# Altium project Combined_Power_Actuator.PrjPcb
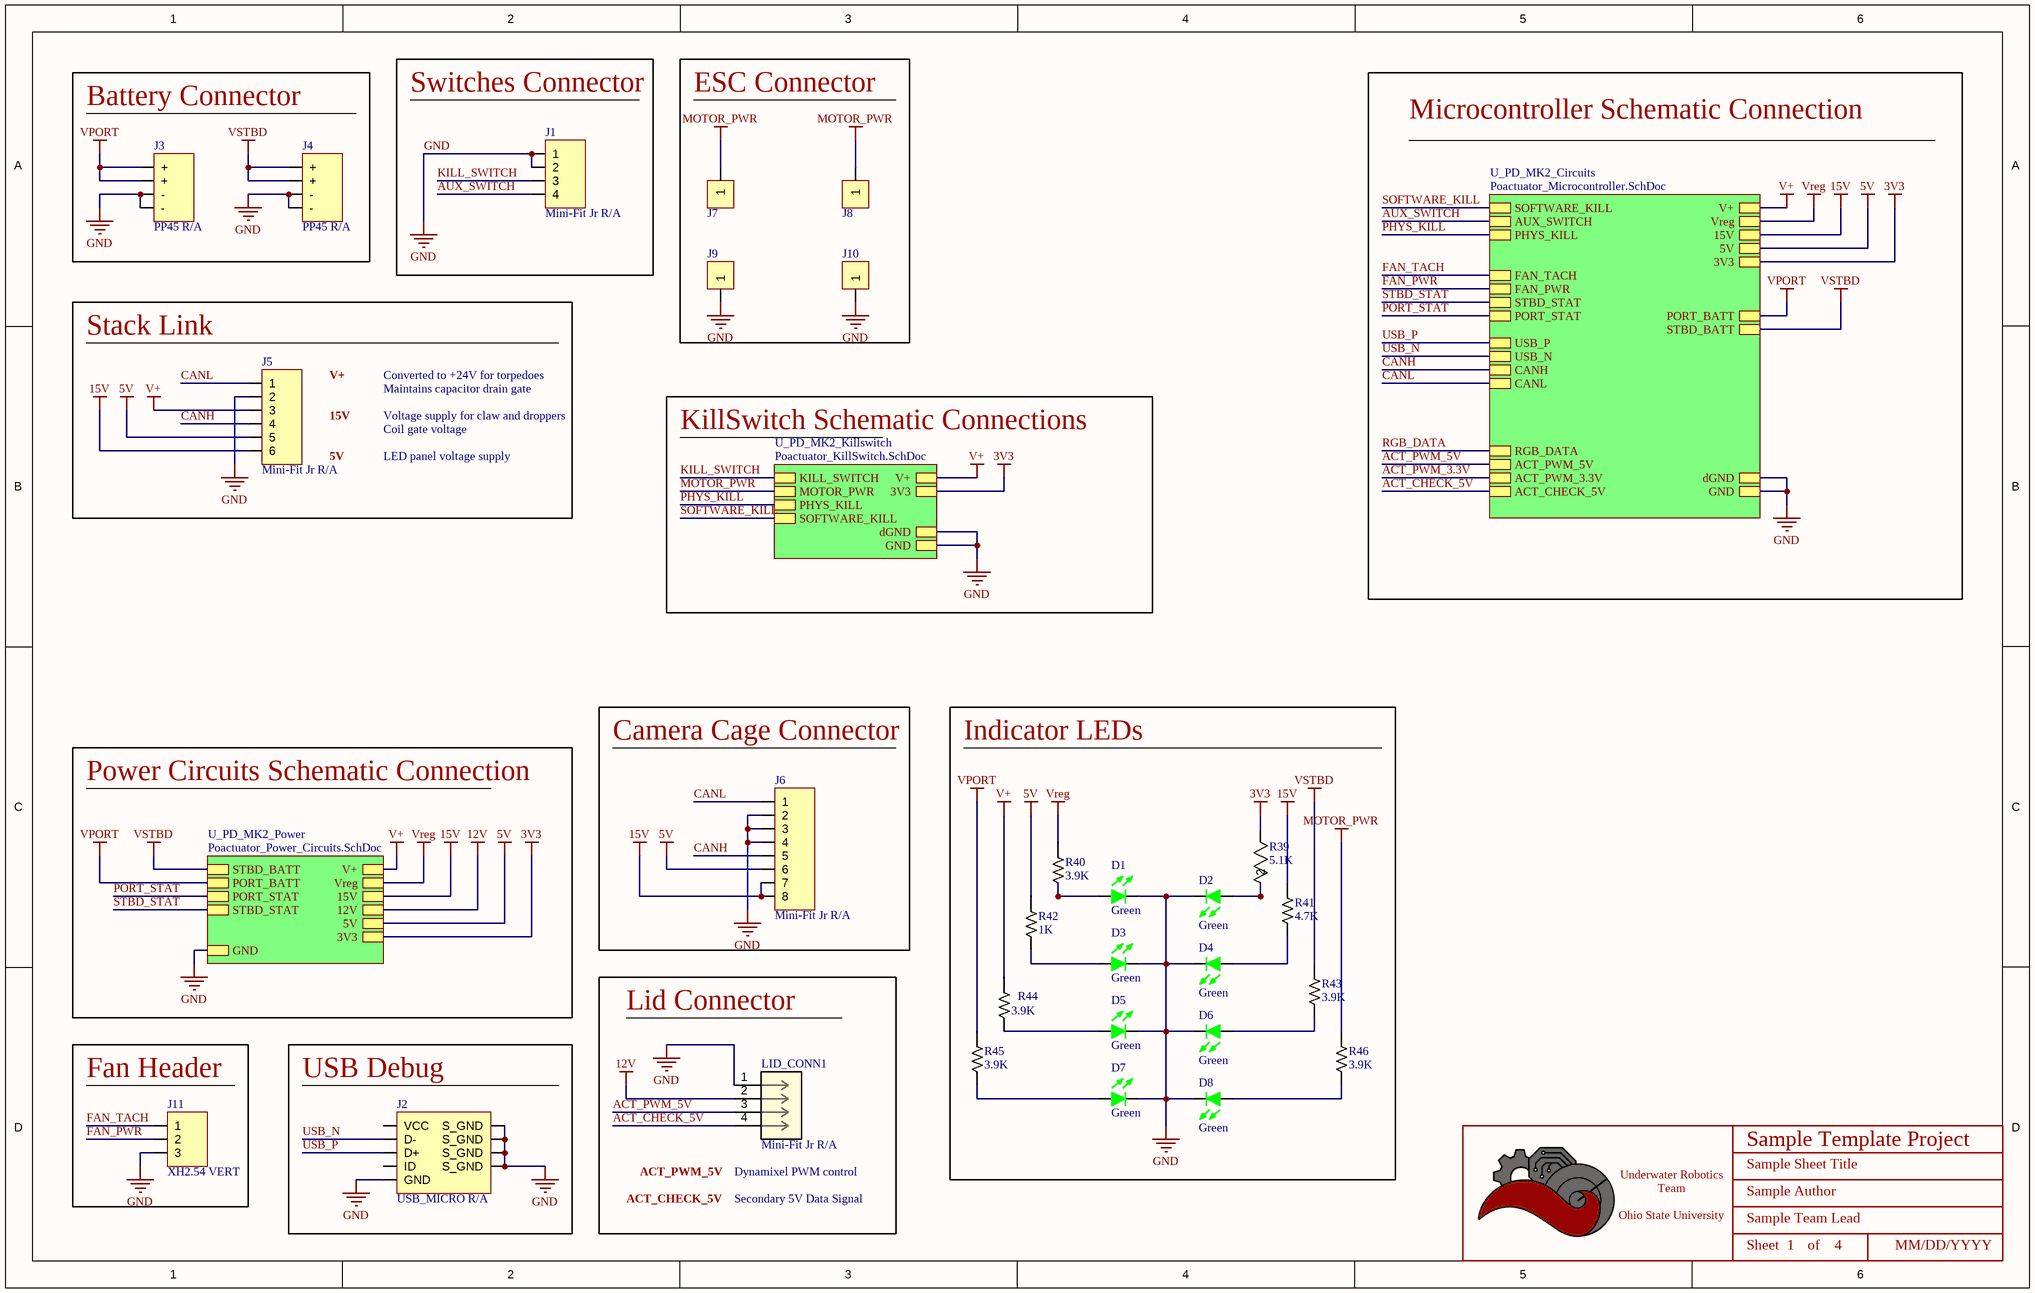
[diagram p0: Poactuator_Connectors.SchDoc]
BoardRevision: 1.0; DateOfDesignReview: XX/XX/XXXX; ProjectTitle: Sample Template Project; TeamLead: Sample Team Lead
4 sheets, 105 parts. Net scope: hierarchical (ports join the sheet entries above them; power ports are global).
Board file: PoactuatorPCB4.PcbDoc
Sheets:
  Poactuator_Connectors.SchDoc
    U_PD_MK2_Power = Poactuator_Power_Circuits.SchDoc
    U_PD_MK2_Circuits = Poactuator_Microcontroller.SchDoc
    U_PD_MK2_Killswitch = Poactuator_KillSwitch.SchDoc

## Sheet Poactuator_Connectors.SchDoc: Sample Sheet Title
size B; Date: MM/DD/YYYY; Author: Sample Author; Organization: ORGANIZATION; Address1: ADDRESS 1; Address2: ADDRESS 2; Address3: ADDRESS 3; Address4: ADDRESS 4; Revision: -; SheetNumber: 1; SheetTotal: 4; ENG_APP_DATE: --/--/--; DSN_APP_DATE: --/--/--; CHK_APP_DATE: --/--/--

### Parts
(Parts that share a designator on the sheet are numbered #1, #2 ... from top to bottom, then left to right.)
*#1  Title_Block  [LOGO]  (value not drawn)  (graphical)
D1  Color: Green  [LED_0603]  (hidden comment: IN-S63AT5G)
D2  Color: Green  [LED_0603]  (hidden comment: IN-S63AT5G)
D3  Color: Green  [LED_0603]  (hidden comment: IN-S63AT5G)
D4  Color: Green  [LED_0603]  (hidden comment: IN-S63AT5G)
D5  Color: Green  [LED_0603]  (hidden comment: IN-S63AT5G)
D6  Color: Green  [LED_0603]  (hidden comment: IN-S63AT5G)
D7  Color: Green  [LED_0603]  (hidden comment: IN-S63AT5G)
D8  Color: Green  [LED_0603]  (hidden comment: IN-S63AT5G)
J1  Mini-Fit Jr R/A  [CONN_MOLEX_MINIFIT JR_4 POS_R/A]
J2  USB_MICRO R/A  [CONN_MINIUSB]
J3  PP45 R/A  [CONN_ANDERSON_PP45_4 POS_R/A]
J4  PP45 R/A  [CONN_ANDERSON_PP45_4 POS_R/A]
J5  Mini-Fit Jr R/A  [CONN_MOLEX_MINIFIT JR_6 POS_R/A]
J6  Mini-Fit Jr R/A  [CONN_MOLEX_MINIFIT JR_8 POS_R/A]
J7  Redcube M4 Term 85A  [Redcube M4 Term 85A]  (value not drawn)
J8  Redcube M4 Term 85A  [Redcube M4 Term 85A]  (value not drawn)
J9  Redcube M4 Term 85A  [Redcube M4 Term 85A]  (value not drawn)
J10  Redcube M4 Term 85A  [Redcube M4 Term 85A]  (value not drawn)
J11  XH2.54 VERT  [CONN_JST_XH254_3POS_VERT]
LID_CONN1  Mini-Fit Jr R/A  [CONN HEADER R/A 4POS 4.2MM]
R39  5.1K  [RC0603N_PAN]
R40  Value  (Ohms): 3.9K  [RESISTOR_0603]  (hidden comment: 3.9k Ohm 5% 1/10W)
R41  Value  (Ohms): 4.7K  [RESISTOR_0603]  (hidden comment: 4.7k Ohm 5% 1/10W)
R42  Value  (Ohms): 1K  [RESISTOR_0603]  (hidden comment: 1k Ohm 5% 1/8W)
R43  Value  (Ohms): 3.9K  [RESISTOR_0603]  (hidden comment: 3.9k Ohm 5% 1/10W)
R44  Value  (Ohms): 3.9K  [RESISTOR_0603]  (hidden comment: 3.9k Ohm 5% 1/10W)
R45  Value  (Ohms): 3.9K  [RESISTOR_0603]  (hidden comment: 3.9k Ohm 5% 1/10W)
R46  Value  (Ohms): 3.9K  [RESISTOR_0603]  (hidden comment: 3.9k Ohm 5% 1/10W)

### Blocks framed on the sheet
Switches Connector: J1
ESC Connector: J7-J10
Battery Connector: J3 J4
Stack Link: J5
Camera Cage Connector: J6
Indicator LEDs: D1-D8 R39-R46
Lid Connector: LID_CONN1
Fan Header: J11
USB Debug: J2

### Sub-sheets
U_PD_MK2_Circuits = Poactuator_Microcontroller.SchDoc: GND, V+, 5V, 3V3, SOFTWARE_KILL, AUX_SWITCH, FAN_TACH, FAN_PWR, 15V, dGND, Vreg, STBD_STAT, PORT_STAT, USB_P, USB_N, STBD_BATT, CANH, CANL, PORT_BATT, RGB_DATA, ACT_PWM_5V, ACT_PWM_3.3V, ACT_CHECK_5V, PHYS_KILL
U_PD_MK2_Killswitch = Poactuator_KillSwitch.SchDoc: KILL_SWITCH, MOTOR_PWR, V+, 3V3, dGND, GND, PHYS_KILL, SOFTWARE_KILL
U_PD_MK2_Power = Poactuator_Power_Circuits.SchDoc: STBD_BATT, PORT_BATT, GND, V+, 15V, 5V, 3V3, PORT_STAT, STBD_STAT, Vreg, 12V

### Nets
3V3: R39.1 ; sheet U_PD_MK2_Power/3V3, sheet U_PD_MK2_Circuits/3V3, sheet U_PD_MK2_Killswitch/3V3
5V: J5.5 J6.6 R42.1 ; sheet U_PD_MK2_Power/5V, sheet U_PD_MK2_Circuits/5V
12V: LID_CONN1.2 ; sheet U_PD_MK2_Power/12V
15V: J5.6 J6.7 J6.8 R41.1 ; sheet U_PD_MK2_Power/15V, sheet U_PD_MK2_Circuits/15V
GND: D1.2 D2.2 D3.2 D4.2 D5.2 D6.2 D7.2 D8.2 J1.1 J1.2 J2.5(GND) J2.6(S_GND) J2.7(S_GND) J2.8(S_GND) J2.9(S_GND) J3.3(-) J3.4(-) J4.3(-) J4.4(-) J5.2 J6.2 J6.3 J6.4 J9.1 J10.1 J11.3 LID_CONN1.1 ; sheet U_PD_MK2_Power/GND, sheet U_PD_MK2_Circuits/GND, sheet U_PD_MK2_Circuits/dGND, sheet U_PD_MK2_Killswitch/dGND, sheet U_PD_MK2_Killswitch/GND
MOTOR_PWR: J7.1 J8.1 R46.1 ; sheet U_PD_MK2_Killswitch/MOTOR_PWR
V+: J5.3 R44.1 ; sheet U_PD_MK2_Power/V+, sheet U_PD_MK2_Circuits/V+, sheet U_PD_MK2_Killswitch/V+
VPORT: J3.1(+) J3.2(+) R45.1 ; sheet U_PD_MK2_Power/PORT_BATT, sheet U_PD_MK2_Circuits/PORT_BATT
Vreg: R40.1 ; sheet U_PD_MK2_Power/Vreg, sheet U_PD_MK2_Circuits/Vreg
VSTBD: J4.1(+) J4.2(+) R43.1 ; sheet U_PD_MK2_Power/STBD_BATT, sheet U_PD_MK2_Circuits/STBD_BATT
ACT_CHECK_5V: LID_CONN1.4 ; sheet U_PD_MK2_Circuits/ACT_CHECK_5V
ACT_PWM_5V: LID_CONN1.3 ; sheet U_PD_MK2_Circuits/ACT_PWM_5V
AUX_SWITCH: J1.4 ; sheet U_PD_MK2_Circuits/AUX_SWITCH
CANH: J5.4 J6.5 ; sheet U_PD_MK2_Circuits/CANH
CANL: J5.1 J6.1 ; sheet U_PD_MK2_Circuits/CANL
FAN_PWR: J11.2 ; sheet U_PD_MK2_Circuits/FAN_PWR
FAN_TACH: J11.1 ; sheet U_PD_MK2_Circuits/FAN_TACH
KILL_SWITCH: J1.3 ; sheet U_PD_MK2_Killswitch/KILL_SWITCH
PHYS_KILL: sheet U_PD_MK2_Circuits/PHYS_KILL, sheet U_PD_MK2_Killswitch/PHYS_KILL
PORT_STAT: sheet U_PD_MK2_Power/PORT_STAT, sheet U_PD_MK2_Circuits/PORT_STAT
RGB_DATA: sheet U_PD_MK2_Circuits/RGB_DATA
SOFTWARE_KILL: sheet U_PD_MK2_Circuits/SOFTWARE_KILL, sheet U_PD_MK2_Killswitch/SOFTWARE_KILL
STBD_STAT: sheet U_PD_MK2_Power/STBD_STAT, sheet U_PD_MK2_Circuits/STBD_STAT
USB_N: J2.2(D-) ; sheet U_PD_MK2_Circuits/USB_N
USB_P: J2.3(D+) ; sheet U_PD_MK2_Circuits/USB_P
NetD1_1: D1.1 R40.2
NetD2_1: D2.1 R39.2
NetD3_1: D3.1 R42.2
NetD4_1: D4.1 R41.2
NetD5_1: D5.1 R44.2
NetD6_1: D6.1 R43.2
NetD7_1: D7.1 R45.2
NetD8_1: D8.1 R46.2

Not connected (* = marked no-connect by the designer): J2 1(VCC) 4(ID)

### Notes on the sheet
- Microcontroller Schematic Connection
- V+
- 15V
- Converted to +24V for torpedoes
- Voltage supply for claw and droppers
- Coil gate voltage
- Maintains capacitor drain gate
- KillSwitch Schematic Connections
- 5V
- LED panel voltage supply
- Power Circuits Schematic Connection
- ACT_PWM_5V
- (near LID_CONN1) Dynamixel PWM control
- ACT_CHECK_5V
- Secondary 5V Data Signal
- DWG. NO.
- REV.
- SHT.
- THIS DOCUMENT AND THE DATA DISCLOSED HEREIN OR HEREWITH IS THE PROPERTY OF ALTIUM LIMITED AND MAY BE FREELY DISTRIBUTED IN WHOLE. NO RIGHTS ARE RESERVED OR EXPRESS OR IMPLIED WARANTEE GIVEN.
- REVISION
- DESCRIPTION
- DATE
- APPROVED
- ENG:
- APPROVALS
- PROJECT
- DSN:
- CHK:
- REFERENCE DOCUMENTS
- PROJECT REVISION:
- TITLE
- DOCUMENT REVISION:
- DESIGN ITEM:
- BOM:
- FAB DWG:
- PCB DWG:
- ASSY DWG:
- SCALE:
- SIZE
- B
- CAGE CODE
- FILE NAME
- DWG NO.
- SHEET
- OF
- REV
- (in symbol Title_Block) Underwater Robotics Team / Ohio State University; Sheet; of

### Library data of the parts
*#1 = Title_Block: UWRT Schematic Title Block Template / Created June 2021, Dylan Trainor
D1-D8 = LED_Green_0603_3V: LED Green Vf= 3V If = 0.005A / IN-S63AT5G; Made By: Robert Pafford; Forward Current: 5mA; ComponentLink1Description: Datasheet; ComponentLink1URL: https://www.we-online.de/katalog/datasheet/150060GS75000.pdf; Forward Voltage: 3V; Package: 0603; Supplier 1: Digi-Key; Supplier Part Number 1: 1830-1062-1-ND
J1 = CONN_MOLEX_MINIFIT JR_4POS_R/A: Molex Minifit Jr. 5569 / 4 Pos R/A Natural; Pitch: 4.2mm; Configuration: Right Angle; Current Per Pin: 13A; Number of Positions: 4; Supplier Part Number 1: WM13112-ND; Supplier 1: Digi-Key; Manufacturer: Molex; Color: Natural; Created By: Flip B; ComponentLink1Description: Datasheet; ComponentLink1URL: https://www.molex.com/pdm_docs/sd/026013115_sd.pdf; Series: Minifit Jr 5569
J2 = CONN_MICROUSB: Amphenol Micro USB-B / USB2.0 5 Pin Right Angle SMD; Pitch: 0.65mm; Current Per Pin: 1.8A; Number of Positions: 5; Manufacturer: Amphenol; Configuration: Right Angle; Color: Silver; Created By: Flip B; ComponentLink1Description: Datasheet; ComponentLink1URL: https://cdn.amphenol-icc.com/media/wysiwyg/files/documentation/datasheet/inputoutput/io_usb_micro.pdf?__cf_chl_jschl_tk__=05693735e19256298f6ef6ca2bb2e65c376a4f56-1625503833-0-Abitsb0-ufjOXJYs_S3J3r2iTn-nObalbmXUksF1VvO_h_WEmRdMlUD1I8-hmWSEVWzY1pirKnrPZWfgY3851qyBZe5ZvnNQePLGIzUgdEIQBVUyW36RsbYpDLEWxJ4horD-5gChFgobLYqwmG5aHl0E8lIn_twwPPrOxilK2gP0q9t_CNOs_u5fMqXvXUrlsOv8tIE2NRlu6NVP8qtkL2GjhlkeTUbDMF8WvvpPDTFOgvZ4Y16Ej8F8AhWos88mo5B1HssXozw0XrkJQIqERITUu6rqloz9kf4ZzhBHtDAt-IkiAFY_Ds9SW8FYKKTtINJVpHZQ6Gyu1FFM4Dc9MO0maE8_mmNcwlxqyRoRk_MPWW8VyByXWM5RSp52jteRKw7FeI9WIYvCbPAOy0Eyib-aseIQsnGbglBcUY6_2xp8GYaJM38H3dNvBPsSOfJBPndKedwKHllxjkucXn6xsN0sDXkpGN-cu8_2bDTJ0g-uUucKSCooYX-ApSDNGpkA_p9zv1SOAD8c0zaZVmtiBsN75QpVz2rzq9_BFxOywPvR; Series: 10118192; Supplier 1: Digi-Key; Supplier Part Number 1: 609-4613-1-ND
J3 J4 = CONN_ANDERSON_2x2_R/A: Anderson PP45 / 4 Pos R/A Red/Black; Pitch: 7.9mm; Configuration: Right Angle; Current Per Pin: 45A; Number of Positions: 4; Manufacturer: Anderson; Color: Red/Black; Created By: Flip B; ComponentLink1Description: Datasheet; ComponentLink1URL: https://www.andersonpower.com/content/dam/app/ecommerce/product-pdfs/DS-PP1545.pdf; Series: PowerPole 45; Supplier 1: Digi-Key; Supplier Part Number 1: 2243-1337G1-ND; Supplier 2: Digi-Key; Supplier Part Number 2: 2243-1336G1-ND; Supplier 3: Digi-Key; Supplier Part Number 3: 2243-1327-BK-ND; Supplier 4: Digi-Key; Supplier Part Number 4: A102007-ND
J5 = CONN_MOLEX_MINIFIT JR_6POS_R/A: Molex Minifit Jr. 5569 / 6 Pos R/A Natural; Pitch: 4.2mm; Configuration: Right Angle; Current Per Pin: 13A; Number of Positions: 8; Manufacturer: Molex; Color: Natural; Created By: Flip B; ComponentLink1Description: Datasheet; ComponentLink1URL: https://www.molex.com/pdm_docs/ps/PS-5556-001.pdf; Series: Minifit Jr 5569; Supplier 1: Digi-Key; Supplier Part Number 1: WM1353-ND
J6 = CONN_MOLEX_MINIFIT JR_8POS_R/A: Molex Minifit Jr. 5569 / 8 Pos R/A Natural; Pitch: 4.2mm; Configuration: Right Angle; Current Per Pin: 13A; Number of Positions: 8; Manufacturer: Molex; Color: Natural; Created By: Flip B; ComponentLink1Description: Datasheet; ComponentLink1URL: https://www.molex.com/pdm_docs/ps/PS-5556-001.pdf; Series: Minifit Jr 5569; Supplier 1: Digi-Key; Supplier Part Number 1: WM1354-ND
J11 = CONN_JST_XH254_3POS_VERT: JST XH 2.54mm Pitch 3 Pos Vertical; Current Per Pin: 4A; Number of Positions: 3; NOTE: Do not use JST 2.5mm parts with this footprint. JST does not make 2.54mm pitch pins, rather only clones make this connector!; Manufacturer: JST; Pitch: 2.54mm; Configuration: Vertical; Color: White; Created By: Robert P; Series: XH 2.54; ComponentLink1Description: Purchase Link; ComponentLink1URL: https://www.amazon.com/460PCS-XH2-54-Connector-Terminal-Connectors/dp/B09DBGVX5C
LID_CONN1 = CONN HEADER R/A 4POS 4.2MM: Mini-Fit Jr Connector Header Through Hole, Right Angle 4 position 0.165" (4.20mm); Manufacturer: Molex; Pitch: 4.2mm; Number of Positions: 4; Max. Current Per Pin: 100mA; Supplier Part Number 1: WM23323-ND; Supplier 1: Digi-Key; Configuration: Right Angle; Color: Natural; Created By: Zach Ramsey; Series: Minifit Jr 5569; ComponentLink2Description: Datasheet; ComponentLink2URL: https://tools.molex.com/pdm_docs/ps/PS-5556-001.pdf
R39 = ERA-3AEB512V_2: 5.1 kOhms ±0.1% 0.1W, 1/10W Chip Resistor 0603 (1608 Metric) Automotive AEC-Q200 Thin Film; Mfr_Name: Panasonic; Copyright: Copyright (C) 2023 Ultra Librarian. All rights reserved.; Manufacturer_Part_Number: ERA-3AEB512V; RefDes: RefDes; Type: DEV
R40 R43-R46 = RESISTOR_3.9K_0603: RES 3.9k OHM 1% 1/10W 0603; Tolerance: +/- 1%; Made By: Robert Pafford; Wattage: 1/10W; Supplier 1: Digi-Key; Supplier Part Number 1: P3.90KHCT-ND
R41 = RESISTOR_4.7K_0603: RES 4.7k OHM 5% 1/10W 0603; Tolerance: +/- 5%; Made By: Robert Pafford; Wattage: 1/10W; Supplier: Digikey; Digikey Part Numer: CR0603-JW-104ELFTR-ND; Supplier 1: Digi-Key; Supplier Part Number 1: RMCF0603JT4K70CT-ND
R42 = RESISTOR_1K_0603: RES 1k OHM 5% 1/8W 0603; Tolerance: +/- 5%; Made By: Robert Pafford; ComponentLink1Description: Datasheet; ComponentLink1URL: https://www.bourns.com/docs/product-datasheets/CRxxxxx.pdf; Wattage: 1/8W; Supplier: Digikey; Digikey Part Numer: CR0603-JW-104ELFTR-ND; Supplier 1: Digi-Key; Supplier Part Number 1: 2019-RK73B1JTTD102JCT-ND
J7-J10 = Redcube M4 Term 85A: Created By: Nahtan Ayer; Current Rating: 85 A; Screw Size: M4

## Sheet Poactuator_Power_Circuits.SchDoc: Sample Sheet Title
size B; Date: MM/DD/YYYY; Author: Sample Author; Organization: ORGANIZATION; Address1: ADDRESS 1; Address2: ADDRESS 2; Address3: ADDRESS 3; Address4: ADDRESS 4; Revision: -; SheetNumber: 2; SheetTotal: 4; ENG_APP_DATE: --/--/--; DSN_APP_DATE: --/--/--; CHK_APP_DATE: --/--/--
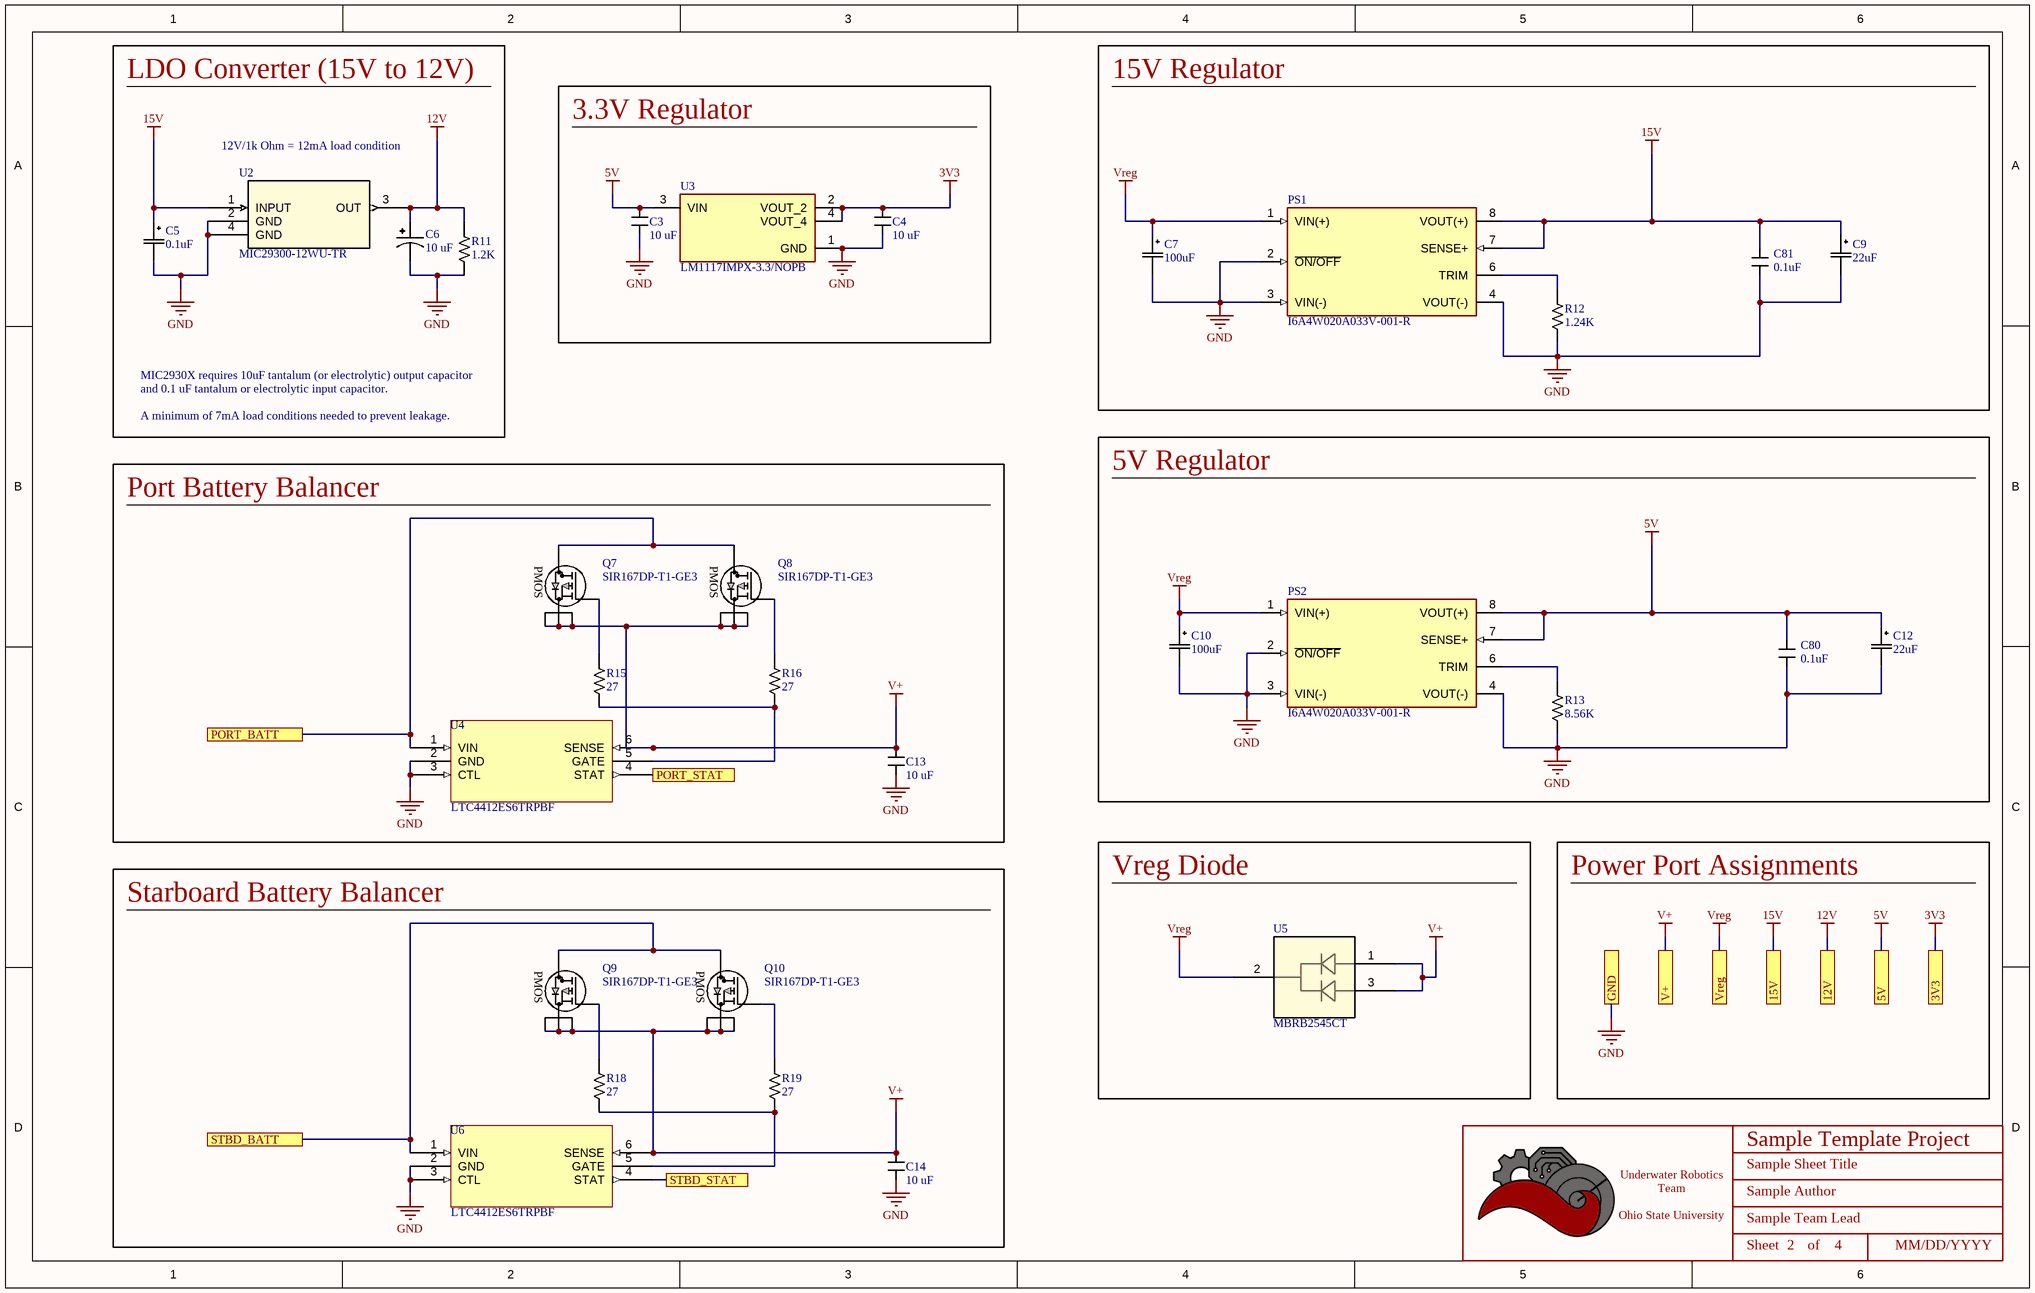
[diagram p1: Poactuator_Power_Circuits.SchDoc]

### Parts
(Parts that share a designator on the sheet are numbered #1, #2 ... from top to bottom, then left to right.)
*#2  Title_Block  [LOGO]  (value not drawn)  (graphical)
C3  Value (uF): 10 uF  [CAPACITOR_0603]  (hidden comment: 10uF Ceramic 6.3V)
C4  Value (uF): 10 uF  [CAPACITOR_0603]  (hidden comment: 10uF Ceramic 6.3V)
C5  value 0.1uF  [U2-D_NCH]  (hidden comment: 0.1uF electrolytic 35 V)
C6  Value (uF): 10 uF  [CAPACITOR_1206 - POLAR]  (hidden comment: 10uF Tantalum 16V)
C7  value 100uF  [PCAP_8x5.4-ELECT_NCA]  (hidden comment: 100uF electrolytic 35 V)
C9  value 22uF  [PCAP_8x5.4-ELECT_NCA]  (hidden comment: 22uF electrolytic 35 V)
C10  value 100uF  [PCAP_8x5.4-ELECT_NCA]  (hidden comment: 100uF electrolytic 35 V)
C12  value 22uF  [PCAP_8x5.4-ELECT_NCA]  (hidden comment: 22uF electrolytic 35 V)
C13  Value (uF): 10 uF  [CAPACITOR_1206]  (hidden comment: 10uF Ceramic 25V)
C14  Value (uF): 10 uF  [CAPACITOR_1206]  (hidden comment: 10uF Ceramic 25V)
C80  Capacitance: 0.1uF  [CL05A104KA5NNNC]  (hidden comment: CL05A104KA5NNNC)
C81  Capacitance: 0.1uF  [CL05A104KA5NNNC]  (hidden comment: CL05A104KA5NNNC)
PS1  I6A4W020A033V-001-R  [CONV_I6A4W020A033V-001-R]
PS2  I6A4W020A033V-001-R  [CONV_I6A4W020A033V-001-R]
Q7  SIR167DP-T1-GE3  [MOSFET_7DP-T1-GE3_VIS]
Q8  SIR167DP-T1-GE3  [MOSFET_7DP-T1-GE3_VIS]
Q9  SIR167DP-T1-GE3  [MOSFET_7DP-T1-GE3_VIS]
Q10  SIR167DP-T1-GE3  [MOSFET_7DP-T1-GE3_VIS]
R11  Value  (Ohms): 1.2K  [RESISTOR_0805]  (hidden comment: 1.2k Ohm 5% 1/2W)
R12  Value (Ohms): 1.24K  [RESISTOR_0603]  (hidden comment: RES 1.24K OHM 1% 1/10W 0603)
R13  Value (Ohms): 8.56K  [RESISTOR_0402]  (hidden comment: RES 8.56K OHM 1% 1/16W 0402)
R15  Value  (Ohms): 27  [RESISTOR_0603]  (hidden comment: 27 Ohm 5% 1/8W)
R16  Value  (Ohms): 27  [RESISTOR_0603]  (hidden comment: 27 Ohm 5% 1/8W)
R18  Value  (Ohms): 27  [RESISTOR_0603]  (hidden comment: 27 Ohm 5% 1/8W)
R19  Value  (Ohms): 27  [RESISTOR_0603]  (hidden comment: 27 Ohm 5% 1/8W)
U2  MIC29300-12WU-TR  [TO-263-3_MCH]
U3  LM1117IMPX-3.3/NOPB  [SOT-223-4]
U4  LTC4412ES6TRPBF  [TSOT-23_S6]
U5  MBRB2545CT  [D2PAK_VIS]
U6  LTC4412ES6TRPBF  [TSOT-23_S6]

### Blocks framed on the sheet
LDO Converter (15V to 12V): C5 C6 R11 U2
15V Regulator: C7 C9 C81 PS1 R12
3.3V Regulator: C3 C4 U3
5V Regulator: C10 C12 C80 PS2 R13
Port Battery Balancer: C13 Q7 Q8 R15 R16 U4
Starboard Battery Balancer: C14 Q9 Q10 R18 R19 U6
Vreg Diode: U5

### Ports
3V3, 5V, 12V, 15V, GND, PORT_BATT, PORT_STAT, STBD_BATT, STBD_STAT, V+, Vreg

### Nets
3V3: C4.1 U3.2(VOUT_2) U3.4(VOUT_4) ; port 3V3
5V: C3.1 C12.1 C80.1 PS2.7(SENSE+) PS2.8(VOUT(+)) U3.3(VIN) ; port 5V
12V: C6.1 R11.1 U2.3(OUT) ; port 12V
15V: C5.1 C9.1 C81.1 PS1.7(SENSE+) PS1.8(VOUT(+)) U2.1(INPUT) ; port 15V
GND: C3.2 C4.2 C5.2 C6.2 C7.2 C9.2 C10.2 C12.2 C13.2 C14.2 C80.2 C81.2 PS1.2(~{ON/OFF}) PS1.3(VIN(-)) PS1.4(VOUT(-)) PS2.2(~{ON/OFF}) PS2.3(VIN(-)) PS2.4(VOUT(-)) R11.2 R12.2 R13.2 U2.2(GND) U2.4(GND) U3.1(GND) U4.2(GND) U4.3(CTL) U6.2(GND) U6.3(CTL) ; port GND
V+: C13.1 C14.1 Q7.1(S) Q7.2(S) Q7.3(S) Q8.1(S) Q8.2(S) Q8.3(S) Q9.1(S) Q9.2(S) Q9.3(S) Q10.1(S) Q10.2(S) Q10.3(S) U4.6(SENSE) U5.1 U5.3 U6.6(SENSE) ; port V+
VPORT: Q7.D Q8.D U4.1(VIN) ; port PORT_BATT
Vreg: C7.1 C10.1 PS1.1(VIN(+)) PS2.1(VIN(+)) U5.2 ; port Vreg
VSTBD: Q9.D Q10.D U6.1(VIN) ; port STBD_BATT
PORT_STAT: U4.4(STAT) ; port PORT_STAT
STBD_STAT: U6.4(STAT) ; port STBD_STAT
NetPS1_6: PS1.6(TRIM) R12.1
NetPS2_6: PS2.6(TRIM) R13.1
NetQ7_4: Q7.4(G) R15.1
NetQ8_4: Q8.4(G) R16.1
NetQ9_4: Q9.4(G) R18.1
NetQ10_4: Q10.4(G) R19.1
NetR15_2: R15.2 R16.2 U4.5(GATE)
NetR18_2: R18.2 R19.2 U6.5(GATE)

### Notes on the sheet
- 12V/1k Ohm = 12mA load condition
- MIC2930X requires 10uF tantalum (or electrolytic) output capacitor
- and 0.1 uF tantalum or electrolytic input capacitor.
- A minimum of 7mA load conditions needed to prevent leakage.
- Power Port Assignments
- DWG. NO.
- REV.
- SHT.
- THIS DOCUMENT AND THE DATA DISCLOSED HEREIN OR HEREWITH IS THE PROPERTY OF ALTIUM LIMITED AND MAY BE FREELY DISTRIBUTED IN WHOLE. NO RIGHTS ARE RESERVED OR EXPRESS OR IMPLIED WARANTEE GIVEN.
- REVISION
- DESCRIPTION
- DATE
- APPROVED
- ENG:
- APPROVALS
- PROJECT
- DSN:
- CHK:
- REFERENCE DOCUMENTS
- PROJECT REVISION:
- TITLE
- DOCUMENT REVISION:
- DESIGN ITEM:
- BOM:
- FAB DWG:
- PCB DWG:
- ASSY DWG:
- SCALE:
- SIZE
- B
- CAGE CODE
- FILE NAME
- DWG NO.
- SHEET
- OF
- REV
- (in symbol SIR167DP-T1-GE3) PMOS
- (in symbol Title_Block) Underwater Robotics Team / Ohio State University; Sheet; of

### Library data of the parts
*#2 = Title_Block: as *#1 on sheet Poactuator_Connectors
C3 C4 = CAPACITOR_10uF_0603: Cap 10uF 6.3V +/-20% / Ceramic 0603; Made By: Flip B; ComponentLink1Description: Digikey; ComponentLink1URL: https://www.digikey.com/en/products/detail/samsung-electro-mechanics/CL10A106MQ8NNNC/3886777; Tolerance: +/- 20%; Voltage: 6.3V; Supplier 1: Digikey; Supplier Part Number 1: 1276-1119-1-ND
C5 = CAP ALUM 0.1UF 20% 35V SMD: 0.1 µF 35 V Aluminum Electrolytic Capacitors Radial, Can - SMD 7000 Hrs @ 105°C; Mfr_Name: Nichicon; Manufacturer_Part_Number: UCB1V0R1MCL1GS; Type: DEV; Made by: Tyson Nguyen; Copyright: Copyright (C) 2022 Ultra Librarian. All rights reserved.; RefDes: RefDes; Supplier 1: Digi-Key; Supplier Part Number 1: 493-9956-1-ND
C6 = CAPACITOR_10uF_1206_Tantalum_1: Cap 10uF 16V +/-20% / Tantalum 1206; Tolerance: +/- 10%; Made By: Dylan T; ComponentLink1Description: Digikey; ComponentLink1URL: https://www.digikey.com/en/products/detail/kyocera-avx/F981A106MMA/4004990; Voltage: 16V; Supplier 1: Newark; Supplier Part Number 1: 26AC4143
C7 C10 = CAP ALUM 100UF 20% 35V SMD: 100 µF 35 V Aluminum Electrolytic Capacitors Radial, Can - SMD 1000 Hrs; Mfr_Name: Nichicon; Manufacturer_Part_Number: UCB1V0R1MCL1GS; Type: DEV; Made by: Tyson Nguyen; Copyright: Copyright (C) 2022 Ultra Librarian. All rights reserved.; RefDes: RefDes; Supplier 1: Mouser; Supplier Part Number 1: 667-EEE-1VA101XP
C9 C12 = CAP ALUM 22UF 20% 35V SMD: 22 µF 35 V Aluminum Electrolytic Capacitors Radial, Can - SMD 1000 Hrs; Made by: Robert Pafford; Voltage: 35V; Supplier 1: Digi-Key; Supplier Part Number 1: PCE3952DKR-ND
C13 C14 = CAPACITOR_10uF_1206: Cap 10uF 25V +/-10% / Ceramic 1206; Made By: Robert Pafford; Tolerance: +/- 10%; Voltage: 25V; Supplier 1: Digi-Key; Supplier Part Number 1: 1276-1804-6-ND
C80 C81 = CAP CER 0.1UF 25V X5R 0402: 0.1 µF ±10% 25V Ceramic Capacitor X5R 0402 (1005 Metric); Name: Zach Ramsey; Tolerance: +/- 10%; ComponentLink1Description: Data Sheet; ComponentLink1URL: https://mm.digikey.com/Volume0/opasdata/d220001/medias/docus/503/CL05A104KA5NNNC.pdf; Rated Voltage: 25V
  C80: Supplier 1: Avnet; Supplier Part Number 1: CL05A104KA5NNNC
  C81: Supplier 1: Digikey; Supplier Part Number 1: 1276-1043-1-ND
PS1 PS2 = I6A4W020A033V-001-R: Non-Isolated PoL Module DC DC Converter 1 Output 3.3 ~ 15V 20A 9V - 53V Input; MF: TDK-Lambda Americas; Availability: In Stock; Price: None; Package: DIP-8 TDK-Lambda; MP: I6A4W020A033V-001-R; Value: *; SnapEDA_Link: https://www.snapeda.com/parts/I6A4W020A033V-001-R/TDK-Lambda%20Americas%20Inc./view-part/1737324/?ref=snap; Check_prices: https://www.snapeda.com/parts/I6A4W020A033V-001-R/TDK-Lambda%20Americas%20Inc./view-part/1737324/?ref=eda; Purchase-URL: https://pricing.snapeda.com/search/part/I6A4W020A033V-001-R/?ref=eda
Q7-Q10 = SIR167DP-T1-GE3: P-Channel 30 V 60A (Tc) 65.8W (Tc) Surface Mount PowerPAK® SO-8; Mfr_Name: Vishay; Type: DEV; Copyright: Copyright (C) 2022 Ultra Librarian. All rights reserved.; Manufacturer_Part_Number: SIR167DP-T1-GE3; RefDes: RefDes; Supplier 1: Mouser; Supplier Part Number 1: 78-SIR167DP-T1-GE3
R11 = RESISTOR_1.2K_0805: RES 1.2k OHM 5% 1/2W 0805; Tolerance: +/- 5%; Made By: Robert Pafford; Wattage: 1/2W; Supplier 1: Digi-Key; Supplier Part Number 1: P1.2KADCT-ND
R12 = RESISTOR_1.24K_1%_0603: 1.24 kOhms ±1% 0.1W, 1/10W Chip Resistor 0603 (1608 Metric) Automotive AEC-Q200 Thick Film; Tolerance: +/- 1%; Wattage: 1/10W; Created By: John Ulm; Verified By: *; Supplier 1: Digi-Key; Supplier Part Number 1: RMCF0603FT1K24CT-ND
R13 = RESISTOR_8.56K_1%_0402: 8.56 kOhms ±1% 0.063W, 1/16W Chip Resistor 0402 (1005 Metric) Automotive AEC-Q200, Moisture Resistant Metal Film; Tolerance: +/- 1%; Made By: John Ulm; Supplier 1: Digi-Key; Supplier Part Number 1: 2019-RN73H1ETTP8561F50CT-ND; Wattage: 1/16W; Verified By: *
R15 R16 R18 R19 = RESISTOR_27_0603: RES 27 OHM 5% 1/8W 0603; Tolerance: +/- 5%; Made By: Robert Pafford; ComponentLink1Description: Datasheet; ComponentLink1URL: https://www.bourns.com/docs/product-datasheets/CRxxxxx.pdf; Wattage: 1/8W; Supplier: Digikey; Digikey Part Numer: CR0603-JW-104ELFTR-ND; Supplier 1: Digi-Key; Supplier Part Number 1: 2019-RK73B1JTTD270JCT-ND
U2 = MIC29300-12WU-TR: Linear Voltage Regulator IC Positive Fixed 1 Output 3A TO-263-3; Mfr_Name: Microchip; Copyright: Copyright (C) 2022 Ultra Librarian. All rights reserved.; Manufacturer_Part_Number: MIC29300-12WU-TR; RefDes: RefDes; Type: DEV; Supplier 1: Arrow Electronics; Supplier Part Number 1: MIC29300-12WU-TR
U3 = LM1117IMPX-3.3/NOPB: 800-mA 15-V linear voltage regulator 4-SOT-223 -40 to 125; MF: Texas Instruments; Texas_Instruments-Purchase-URL: https://snapeda.com/shop?store=Texas+Instruments&id=410186; Price: None; Mouser-Purchase-URL: https://snapeda.com/shop?store=Mouser&id=410186; MP: LM1117IMPX-3.3/NOPB; Value: *; Availability: Good; Package: SOT-223-4 Texas Instruments; Arrow_Electronics-Purchase-URL: https://snapeda.com/shop?store=Arrow+Electronics&id=410186; SnapEDA_Link: https://www.snapeda.com/parts/LM1117IMPX-3.3/NOPB/Texas%20Instruments/view-part/410186/?ref=snap; DigiKey-Purchase-URL: https://snapeda.com/shop?store=DigiKey&id=410186
U4 U6 = LTC4412ES6TRPBF: OR Controller Source Selector Switch P-Channel 2:1 TSOT-23-6; MP: LTC4412ES6#TRPBF; MF: Analog Devices; Price: None; Availability: Good; Mouser-Purchase-URL: https://snapeda.com/shop?store=Mouser&id=4343773; Arrow_Europe-Purchase-URL: https://snapeda.com/shop?store=Arrow+Europe&id=4343773; DigiKey-Purchase-URL: https://snapeda.com/shop?store=DigiKey&id=4343773; Package: SOT-23-6 Analog Devices; SnapEDA_Link: https://www.snapeda.com/parts/LTC4412ES6%23TRPBF/Analog%20Devices/view-part/4343773/?ref=snap; Value: *; Check_prices: https://www.snapeda.com/parts/LTC4412ES6%23TRPBF/Analog%20Devices/view-part/4343773/?ref=eda; Supplier 1: Mouser; Supplier Part Number 1: 584-LTC4412ES6#TRPBF
U5 = MBRB2545CT: Diode Array 1 Pair Common Cathode 45 V Surface Mount TO-263-3, D²Pak (2 Leads + Tab), TO-263AB; Mfr_Name: Vishay; Copyright: Copyright (C) 2023 Ultra Librarian. All rights reserved.; Manufacturer_Part_Number: MBRB2545CT; RefDes: RefDes; Type: DEV; ComponentLink1Description: Supplier Link; ComponentLink1URL: https://www.digikey.com/en/products/detail/smc-diode-solutions/MBRB2545CT/6022901

## Sheet Poactuator_Microcontroller.SchDoc: Sample Sheet Title
size B; Date: MM/DD/YYYY; Author: Sample Author; Organization: ORGANIZATION; Address1: ADDRESS 1; Address2: ADDRESS 2; Address3: ADDRESS 3; Address4: ADDRESS 4; Revision: -; SheetNumber: 3; SheetTotal: 6; ENG_APP_DATE: --/--/--; DSN_APP_DATE: --/--/--; CHK_APP_DATE: --/--/--
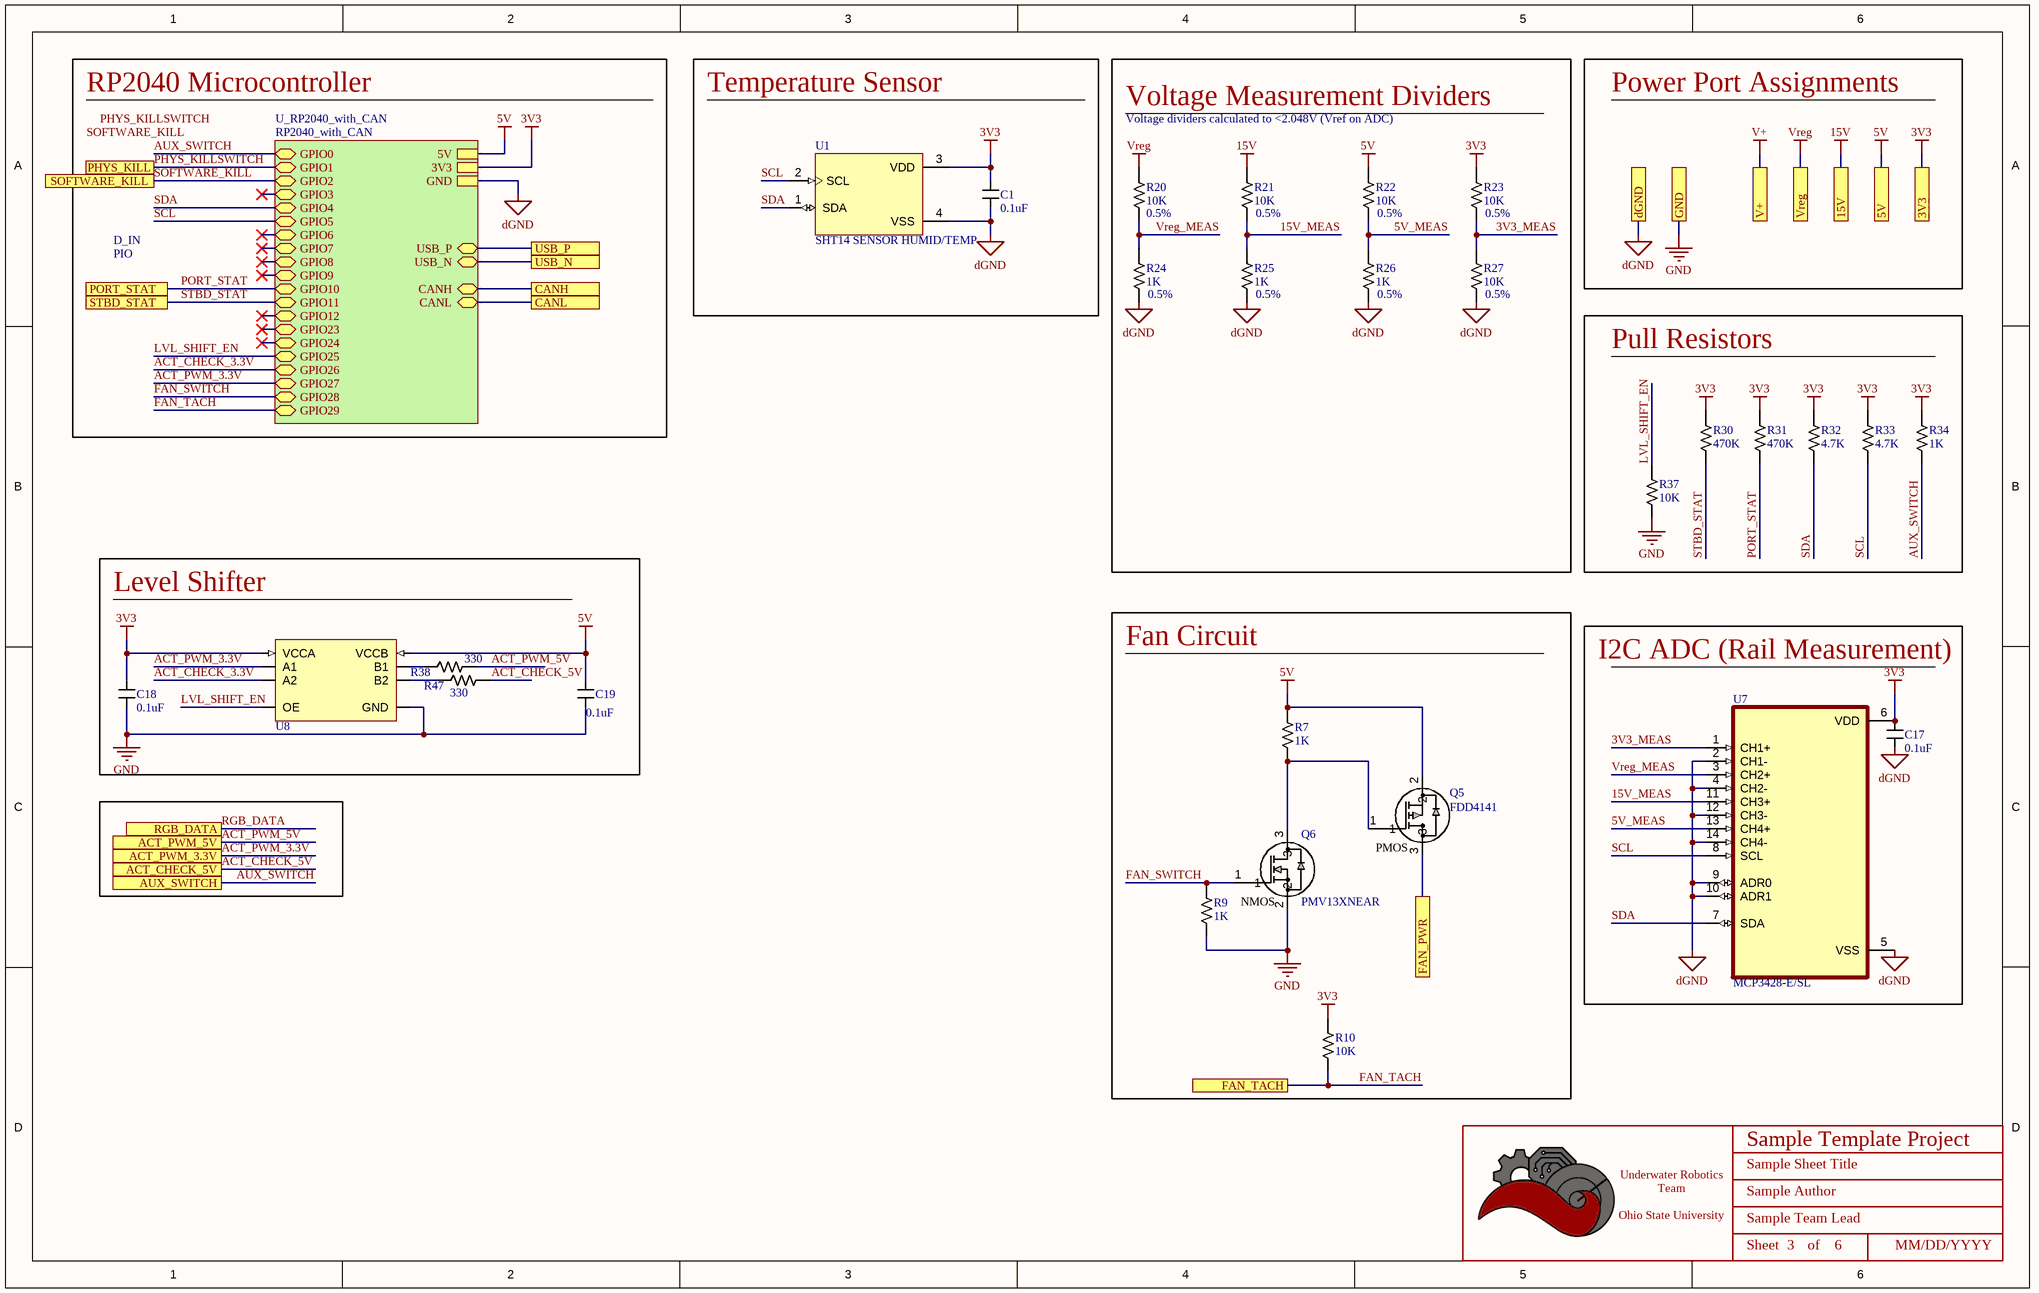
[diagram p2: Poactuator_Microcontroller.SchDoc]

### Parts
(Parts that share a designator on the sheet are numbered #1, #2 ... from top to bottom, then left to right.)
*#3  Title_Block  [LOGO]  (value not drawn)  (graphical)
C1  value 0.1uF  [CAPACITOR_0603]  (hidden comment: 100nF Ceramic 6.3V)
C17  value 0.1uF  [CAPACITOR_0603]  (hidden comment: 100nF Ceramic 6.3V)
C18  value 0.1uF  [CAPACITOR_0603]  (hidden comment: 100nF Ceramic 6.3V)
C19  value 0.1uF  [CAPACITOR_0603]  (hidden comment: 100nF Ceramic 6.3V)
Q5  FDD4141  [DPAK_ONS]
Q6  PMV13XNEAR  [SOT-23-3]
R7  Value  (Ohms): 1K  [RESISTOR_0603]  (hidden comment: 1k Ohm 5% 1/8W)
R9  Value  (Ohms): 1K  [RESISTOR_0603]  (hidden comment: 1k Ohm 5% 1/8W)
R10  Value  (Ohms): 10K  [RESISTOR_0603]  (hidden comment: 10k Ohm 5% 1/10W)
R20  Value  (Ohms): 10K  [RESISTOR_0603]  (hidden comment: 10k Ohm 0.5% 1/10W)
R21  Value  (Ohms): 10K  [RESISTOR_0603]  (hidden comment: 10k Ohm 0.5% 1/10W)
R22  Value  (Ohms): 10K  [RESISTOR_0603]  (hidden comment: 10k Ohm 0.5% 1/10W)
R23  Value  (Ohms): 10K  [RESISTOR_0603]  (hidden comment: 10k Ohm 0.5% 1/10W)
R24  Value  (Ohms): 1K  [RESISTOR_0603]  (hidden comment: 1k Ohm 5% 1/10W)
R25  Value  (Ohms): 1K  [RESISTOR_0603]  (hidden comment: 1k Ohm 5% 1/10W)
R26  Value  (Ohms): 1K  [RESISTOR_0603]  (hidden comment: 1k Ohm 5% 1/10W)
R27  Value  (Ohms): 10K  [RESISTOR_0603]  (hidden comment: 10k Ohm 0.5% 1/10W)
R30  Value  (Ohms): 470K  [RESISTOR_0603]  (hidden comment: 470k Ohm 5% 1/10W)
R31  Value  (Ohms): 470K  [RESISTOR_0603]  (hidden comment: 470k Ohm 5% 1/10W)
R32  Value  (Ohms): 4.7K  [RESISTOR_0603]  (hidden comment: 4.7k Ohm 5% 1/10W)
R33  Value  (Ohms): 4.7K  [RESISTOR_0603]  (hidden comment: 4.7k Ohm 5% 1/10W)
R34  Value  (Ohms): 1K  [RESISTOR_0603]  (hidden comment: 1k Ohm 5% 1/8W)
R37  Value  (Ohms): 10K  [RESISTOR_0603]  (hidden comment: 10k Ohm 5% 1/10W)
R38  Value  (Ohms): 330  [RESISTOR_0603]  (hidden comment: 330 Ohm 1% 1/10W)
R47  Value  (Ohms): 330  [RESISTOR_0603]  (hidden comment: 330 Ohm 1% 1/10W)
U1  SHT14 SENSOR HUMID/TEMP  [XDCR_SHT41-AD1B-R2]
U7  MCP3428-E/SL  [SOIC127P600X175-14N]
U8  IC TRANSLTR BIDIRECTIONAL 8VSSOP  [TXB0102DCUR]  (value not drawn)

### Blocks framed on the sheet
Temperature Sensor: C1 U1
Pull Resistors: R30-R34 R37
Level Shifter: C18 C19 R38 R47 U8
Fan Circuit: Q5 Q6 R7 R9 R10
I2C ADC (Rail Measurement): C17 U7

### Sub-sheets
U_RP2040_with_CAN = RP2040_with_CAN (file not in this document): USB_P (bidir), USB_N (bidir), 5V, CANH (bidir), CANL (bidir), GPIO0 (bidir), GPIO1 (bidir), GPIO2 (bidir), GPIO3 (bidir), GPIO4 (bidir), GPIO5 (bidir), GPIO6 (bidir), GPIO7 (bidir), GPIO8 (bidir), GPIO9 (bidir), GPIO10 (bidir), GPIO11 (bidir), GPIO12 (bidir), GPIO23 (bidir), GPIO24 (bidir), GPIO25 (bidir), GPIO26 (bidir), GPIO27 (bidir), GPIO28 (bidir), GPIO29 (bidir), 3V3, GND

### Ports
3V3, 5V, 15V, ACT_CHECK_5V, ACT_PWM_3.3V, ACT_PWM_5V, AUX_SWITCH, CANH, CANL, dGND, FAN_PWR, FAN_TACH, GND, PHYS_KILL, PORT_STAT, RGB_DATA, SOFTWARE_KILL, STBD_STAT, USB_N, USB_P, V+, Vreg

### Nets
3V3: C1.1 C17.1 C18.1 R10.1 R23.1 R30.1 R31.1 R32.1 R33.1 R34.1 U1.3(VDD) U7.6(VDD) U8.1(VCCA) ; port 3V3, sheet U_RP2040_with_CAN/3V3
5V: C19.1 Q5.2 R7.1 R22.1 U8.8(VCCB) ; port 5V, sheet U_RP2040_with_CAN/5V
15V: R21.1 ; port 15V
GND: C1.2 C17.2 C18.2 C19.2 Q6.2 R9.2 R24.2 R25.2 R26.2 R27.2 R37.2 U1.4(VSS) U7.2(CH1-) U7.4(CH2-) U7.5(VSS) U7.9(ADR0) U7.10(ADR1) U7.12(CH3-) U7.14(CH4-) U8.5(GND) ; port GND, port dGND, sheet U_RP2040_with_CAN/GND  [also labelled dGND]
Vreg: R20.1 ; port Vreg
3V3_MEAS: R23.2 R27.1 U7.1(CH1+)
5V_MEAS: R22.2 R26.1 U7.13(CH4+)
15V_MEAS: R21.2 R25.1 U7.11(CH3+)
ACT_CHECK_3.3V: U8.3(A2) ; sheet U_RP2040_with_CAN/GPIO26
ACT_CHECK_5V: R47.1 ; port ACT_CHECK_5V
ACT_PWM_3.3V: U8.2(A1) ; port ACT_PWM_3.3V, sheet U_RP2040_with_CAN/GPIO27
ACT_PWM_5V: R38.1 ; port ACT_PWM_5V
AUX_SWITCH: R34.2 ; port AUX_SWITCH, sheet U_RP2040_with_CAN/GPIO0
CANH: port CANH, sheet U_RP2040_with_CAN/CANH
CANL: port CANL, sheet U_RP2040_with_CAN/CANL
FAN_PWR: Q5.3 ; port FAN_PWR
FAN_SWITCH: Q6.1 R9.1 ; sheet U_RP2040_with_CAN/GPIO28
FAN_TACH: R10.2 ; port FAN_TACH, sheet U_RP2040_with_CAN/GPIO29
LVL_SHIFT_EN: R37.1 U8.4(OE) ; sheet U_RP2040_with_CAN/GPIO25
PHYS_KILLSWITCH: port PHYS_KILL, sheet U_RP2040_with_CAN/GPIO1  [project net PHYS_KILL]
PORT_STAT: R31.2 ; port PORT_STAT, sheet U_RP2040_with_CAN/GPIO10
RGB_DATA: port RGB_DATA
SCL: R33.2 U1.2(SCL) U7.8(SCL) ; sheet U_RP2040_with_CAN/GPIO5
SDA: R32.2 U1.1(SDA) U7.7(SDA) ; sheet U_RP2040_with_CAN/GPIO4
SOFTWARE_KILL: port SOFTWARE_KILL, sheet U_RP2040_with_CAN/GPIO2
STBD_STAT: R30.2 ; port STBD_STAT, sheet U_RP2040_with_CAN/GPIO11
USB_N: port USB_N, sheet U_RP2040_with_CAN/USB_N
USB_P: port USB_P, sheet U_RP2040_with_CAN/USB_P
Vreg_MEAS: R20.2 R24.1 U7.3(CH2+)
NetQ5_1: Q5.1 Q6.3 R7.2
NetR38_2: R38.2 U8.7(B1)
NetR47_2: R47.2 U8.6(B2)

### Notes on the sheet
- RP2040 Microcontroller
- Power Port Assignments
- Voltage Measurement Dividers
- Voltage dividers calculated to <2.048V (Vref on ADC)
- (near R20) 0.5%
- (near R21) 0.5%
- (near R22) 0.5%
- (near R23) 0.5%
- D_IN
- PIO
- (near R24) 0.5%
- (near R25) 0.5%
- (near R26) 0.5%
- (near R27) 0.5%
- Labels drawn without touching a wire or pin: PHYS_KILLSWITCH, SOFTWARE_KILL
- DWG. NO.
- REV.
- SHT.
- THIS DOCUMENT AND THE DATA DISCLOSED HEREIN OR HEREWITH IS THE PROPERTY OF ALTIUM LIMITED AND MAY BE FREELY DISTRIBUTED IN WHOLE. NO RIGHTS ARE RESERVED OR EXPRESS OR IMPLIED WARANTEE GIVEN.
- REVISION
- DESCRIPTION
- DATE
- APPROVED
- ENG:
- APPROVALS
- PROJECT
- DSN:
- CHK:
- REFERENCE DOCUMENTS
- PROJECT REVISION:
- TITLE
- DOCUMENT REVISION:
- DESIGN ITEM:
- BOM:
- FAB DWG:
- PCB DWG:
- ASSY DWG:
- SCALE:
- SIZE
- B
- CAGE CODE
- FILE NAME
- DWG NO.
- SHEET
- OF
- REV
- (in symbol FDD4141) PMOS
- (in symbol PMV13XNEAR) NMOS
- (in symbol Title_Block) Underwater Robotics Team / Ohio State University; Sheet; of

### Library data of the parts
*#3 = Title_Block: as *#1 on sheet Poactuator_Connectors
C1 C17-C19 = CAPACITOR_0.1uF_0603: Cap 100nF 6.3V +/-10% / Ceramic 0603; Made By: Flip B; ComponentLink1Description: Datsheet; ComponentLink1URL: https://www.mouser.com/datasheet/2/212/KEM_C1002_X7R_SMD-1102033.pdf; Tolerance: +/- 10%; Voltage: 6.3V; Supplier 1: Digi-Key; Supplier Part Number 1: 399-15351-1-ND
Q5 = FDD4141: P-Channel 10.8A (Ta), 50A (Tc) 2.4W (Ta), 69W (Tc) Surface Mount D-PAK (TO-252AA); FET Type: P-Channel, Power; Vendor: ON Semiconductor; SourceLibrary: ON_Semiconductor_2020-01-13; Vgs (Max): ±20V; Vgs (th): 3V @ 250µA; Vdss: 40 V; Rds (on): 12.3mOhm @ 12.7A, 10V; Amp Rating: 10.8 A; Package: D-PAK (TO-252AA); Manufacturer_Part_Number: FDD4141; Power Dissipation: 2.4W (Ta), 69W (Tc); Supplier 1: Digi-Key; Supplier Part Number 1: FDD4141CT-ND; Created By: Dylan T
Q6 = PMV13XNEAR: N-Channel 20 V 7.3A (Ta) 610mW (Ta), 8.3W (Tc) Surface Mount TO-236AB; Vendor: Nexperia USA Inc.; SourceLibrary: ON_Semiconductor_2020-01-13; Vgs (Max): +/- 12 V; Vgs (th): 1.3V @ 250uA; Vdss: 20 V; Rds (on): 15mOhm @ 7.3A, 8V; Amp Rating: 7.3 A; FET Type: N-Channel; Package: SOT23-3L; Manufacturer _Part_Number: PMV13XNEAR; Power Dissipation: 610mW (Ta), 8.3W (Tc); Created By: Dylan T; Supplier 1: Mouser; Supplier Part Number 1: 771-PMV13XNEAR
R7 R9 R34 = RESISTOR_1K_0603: as R42 on sheet Poactuator_Connectors; ComponentLink1Description: Datasheet; ComponentLink1URL: https://www.bourns.com/docs/product-datasheets/CRxxxxx.pdf; Wattage: 1/8W; Supplier: Digikey; Digikey Part Numer: CR0603-JW-104ELFTR-ND; Supplier 1: Digi-Key; Supplier Part Number 1: 2019-RK73B1JTTD102JCT-ND
R10 R37 = RESISTOR_10K_0603: RES 10k OHM 5% 1/10W 0603; Tolerance: +/- 5%; Wattage: 1/8W; Made By: Robert Pafford; ComponentLink1Description: Datasheet; ComponentLink1URL: https://www.bourns.com/docs/product-datasheets/CRxxxxx.pdf; Supplier: Digikey; Digikey Part Numer: CR0603-JW-104ELFTR-ND; Supplier 1: Digi-Key; Supplier Part Number 1: 2019-RK73B1JTTD103JCT-ND
R20-R23 R27 = RESISTOR_10K_0.5%_0603: RES 10k OHM 0.5% 1/10W 0603; Tolerance: +/- 0.5%; Made By: Robert Pafford; Wattage: 1/10W; Supplier: Digikey; Digikey Part Numer: CR0603-JW-104ELFTR-ND; Supplier 1: Digi-Key; Supplier Part Number 1: 749-1695-1-ND
R24-R26 = RESISTOR_1K_0.5%_0603: RES 1k OHM 0.5% 1/10W 0603; Tolerance: +/- 0.5%; Made By: Robert Pafford; Wattage: 1/10W; Supplier: Digikey; Digikey Part Numer: CR0603-JW-104ELFTR-ND; Supplier 1: Digi-Key; Supplier Part Number 1: 749-1693-1-ND
R30 R31 = RESISTOR_470K_0603: RES 470k OHM 5% 1/10W 0603; Tolerance: +/- 5%; Made By: Robert P; ComponentLink1Description: Datasheet; ComponentLink1URL: https://www.bourns.com/docs/product-datasheets/CRxxxxx.pdf; Wattage: 1/10W; Supplier 1: Digi-Key; Supplier Part Number 1: RMCF0603JT470KCT-ND
R32 R33 = RESISTOR_4.7K_0603: as R41 on sheet Poactuator_Connectors; Wattage: 1/10W; Supplier: Digikey; Digikey Part Numer: CR0603-JW-104ELFTR-ND; Supplier 1: Digi-Key; Supplier Part Number 1: RMCF0603JT4K70CT-ND
R38 R47 = RESISTOR_330_0603: RES 330 OHM 1% 1/10W 0603; Tolerance: +/- 1%; Made By: Robert Pafford; Wattage: 1/10W; Supplier 1: Digi-Key; Supplier Part Number 1: P330HCT-ND
U1 = SHT41-AD1B-R2: Digital Relative Humidity Temperature Sensor, Â±1.8 / max 2.5 %RH, Â±0.2 Â°C, Ultra-Low-Power; MF: Sensirion; Price: None; SnapEDA_Link: https://www.snapeda.com/parts/SHT41-AD1B-R2/Sensirion/view-part/?ref=snap; MP: SHT41-AD1B-R2; Purchase-URL: https://pricing.snapeda.com/search/part/SHT41-AD1B-R2/?ref=eda; Value: *; Availability: In Stock; Package: None; Check_prices: https://www.snapeda.com/parts/SHT41-AD1B-R2/Sensirion/view-part/?ref=eda; Supplier 1: Digi-Key; Supplier Part Number 1: 1649-SHT41-AD1B-R2CT-ND
U7 = MCP3428-E/SL: 16 Bit Analog to Digital Converter 4 Input 1 Sigma-Delta 14-SOIC; MF: Microchip; Package: SOIC-14 Microchip; SnapEDA_Link: https://www.snapeda.com/parts/MCP3428-E/SL/Microchip/view-part/13249/?ref=snap; MP: MCP3428-E/SL; Price: None; Availability: Unavailable; Value: *
U8 = TXB0102DCUR: Voltage Level Translator Bidirectional 1 Circuit 2 Channel 20Mbps 8-MSOP; Made By: Zach Ramsey; Channels: 2; Voltage Range (VCCA): 1.2 V ~ 3.6 V; Max Rate: 100 Mbps; Voltage Range (VCCB): 1.65 V ~ 5.5 V; Supplier 1: Digi-Key; Supplier Part Number 1: TXB0102DCUR; Channel Type: Bidirectional

## Sheet Poactuator_KillSwitch.SchDoc: Sample Sheet Title
size B; Date: MM/DD/YYYY; Author: Sample Author; Organization: ORGANIZATION; Address1: ADDRESS 1; Address2: ADDRESS 2; Address3: ADDRESS 3; Address4: ADDRESS 4; Revision: -; SheetNumber: 6; SheetTotal: 6; ENG_APP_DATE: --/--/--; DSN_APP_DATE: --/--/--; CHK_APP_DATE: --/--/--
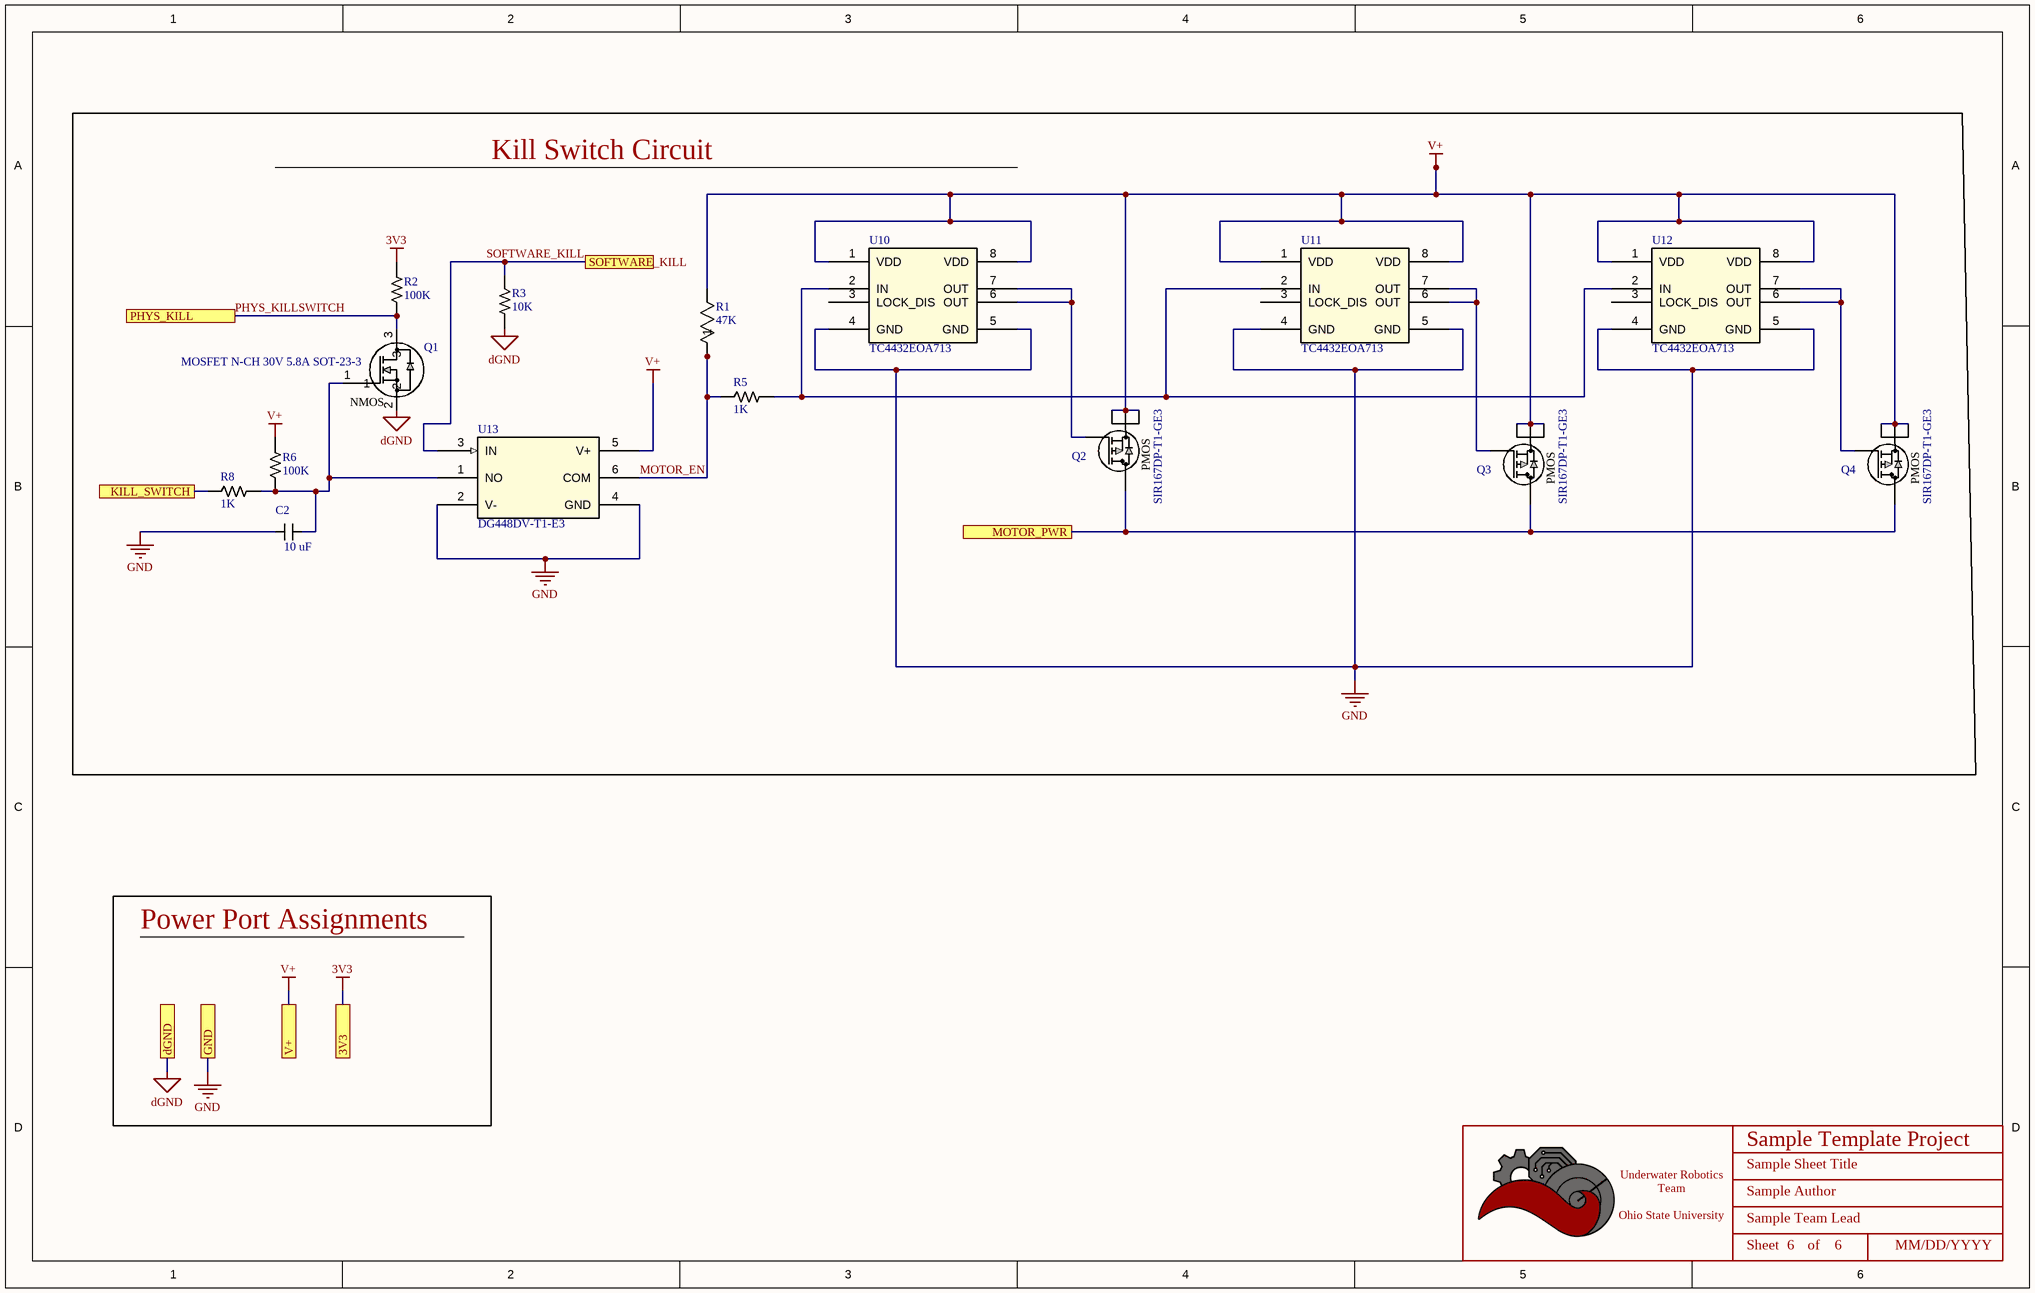
[diagram p3: Poactuator_KillSwitch.SchDoc]

### Parts
(Parts that share a designator on the sheet are numbered #1, #2 ... from top to bottom, then left to right.)
*#4  Title_Block  [LOGO]  (value not drawn)  (graphical)
C2  Value (uF): 10 uF  [CAPACITOR_1206]  (hidden comment: 10uF Ceramic 25V)
Q1  MOSFET N-CH 30V 5.8A SOT-23-3  [SOT-23-3]
Q2  SIR167DP-T1-GE3  [MOSFET_7DP-T1-GE3_VIS]
Q3  SIR167DP-T1-GE3  [MOSFET_7DP-T1-GE3_VIS]
Q4  SIR167DP-T1-GE3  [MOSFET_7DP-T1-GE3_VIS]
R1  47K  [RES_RC0603_YAG]
R2  Value  (Ohms): 100K  [RESISTOR_0603]  (hidden comment: 100k Ohm 0.5% 1/10W)
R3  Value  (Ohms): 10K  [RESISTOR_0603]  (hidden comment: 10k Ohm 5% 1/10W)
R5  Value  (Ohms): 1K  [RESISTOR_0402]  (hidden comment: 1k Ohm 1% 1/16W)
R6  Value  (Ohms): 100K  [RESISTOR_0603]  (hidden comment: 100k Ohm 0.5% 1/10W)
R8  Value  (Ohms): 1K  [RESISTOR_0603]  (hidden comment: 1k Ohm 5% 1/8W)
U10  TC4432EOA713  [SOIC8-N_MC_MCH]
U11  TC4432EOA713  [SOIC8-N_MC_MCH]
U12  TC4432EOA713  [SOIC8-N_MC_MCH]
U13  DG448DV-T1-E3  [TSOP6_DG_VIS-M]

### Blocks framed on the sheet
Kill Switch Circuit: C2 Q1-Q4 R1-R3 R5 R6 R8 U10-U13

### Ports
3V3, dGND, GND, KILL_SWITCH, MOTOR_PWR, PHYS_KILL, SOFTWARE_KILL, V+

### Nets
3V3: R2.1 ; port 3V3
GND: C2.2 Q1.2 R3.1 U10.4(GND) U10.5(GND) U11.4(GND) U11.5(GND) U12.4(GND) U12.5(GND) U13.2(V-) U13.4(GND) ; port GND, port dGND  [also labelled dGND]
MOTOR_PWR: Q2.D Q3.D Q4.D ; port MOTOR_PWR
V+: Q2.1(S) Q2.2(S) Q2.3(S) Q3.1(S) Q3.2(S) Q3.3(S) Q4.1(S) Q4.2(S) Q4.3(S) R1.2 R6.1 U10.1(VDD) U10.8(VDD) U11.1(VDD) U11.8(VDD) U12.1(VDD) U12.8(VDD) U13.5(V+) ; port V+
KILL_SWITCH: R8.2 ; port KILL_SWITCH
MOTOR_EN: R1.1 R5.2 U13.6(COM)
PHYS_KILLSWITCH: Q1.3 R2.2 ; port PHYS_KILL  [project net PHYS_KILL]
SOFTWARE_KILL: R3.2 U13.3(IN) ; port SOFTWARE_KILL
NetC2_1: C2.1 Q1.1 R6.2 R8.1 U13.1(NO)
NetQ2_4: Q2.4(G) U10.6(OUT) U10.7(OUT)
NetQ3_4: Q3.4(G) U11.6(OUT) U11.7(OUT)
NetQ4_4: Q4.4(G) U12.6(OUT) U12.7(OUT)
NetR5_1: R5.1 U10.2(IN) U11.2(IN) U12.2(IN)

Not connected (* = marked no-connect by the designer): U10 3(LOCK_DIS); U11 3(LOCK_DIS); U12 3(LOCK_DIS)

### Notes on the sheet
- Power Port Assignments
- DWG. NO.
- REV.
- SHT.
- THIS DOCUMENT AND THE DATA DISCLOSED HEREIN OR HEREWITH IS THE PROPERTY OF ALTIUM LIMITED AND MAY BE FREELY DISTRIBUTED IN WHOLE. NO RIGHTS ARE RESERVED OR EXPRESS OR IMPLIED WARANTEE GIVEN.
- REVISION
- DESCRIPTION
- DATE
- APPROVED
- ENG:
- APPROVALS
- PROJECT
- DSN:
- CHK:
- REFERENCE DOCUMENTS
- PROJECT REVISION:
- TITLE
- DOCUMENT REVISION:
- DESIGN ITEM:
- BOM:
- FAB DWG:
- PCB DWG:
- ASSY DWG:
- SCALE:
- SIZE
- B
- CAGE CODE
- FILE NAME
- DWG NO.
- SHEET
- OF
- REV
- (in symbol AO3404A) NMOS
- (in symbol SIR167DP-T1-GE3) PMOS
- (in symbol Title_Block) Underwater Robotics Team / Ohio State University; Sheet; of

### Library data of the parts
*#4 = Title_Block: as *#1 on sheet Poactuator_Connectors
C2 = CAPACITOR_10uF_1206: as C13 on sheet Poactuator_Power_Circuits; Tolerance: +/- 10%; Voltage: 25V; Supplier 1: Digi-Key; Supplier Part Number 1: 1276-1804-6-ND
Q1 = AO3404A: N-Channel 30 V 5.8A (Ta) 1.4W (Ta) Surface Mount SOT-23-3; Vendor: Alpha & Omega Semiconductor Inc.; SourceLibrary: ON_Semiconductor_2020-01-13; Vgs (Max): 3V @ 5.8A, 10V; Vgs (th): 3V @ 250µA; Rds (on): 28mOhm @ 5.8A, 10V; Amp Rating: 5.8 A; FET Type: N-Channel; Package: SOT23-3L; Manufacturer _Part_Number: AO3404A; Vdss: 30V; Power Dissipation: 1.4W (Ta); Supplier 1: Digi-Key; Supplier Part Number 1: 785-1004-1-ND; Created By: Dylan T
Q2-Q4 = SIR167DP-T1-GE3: as Q7 on sheet Poactuator_Power_Circuits; Copyright: Copyright (C) 2022 Ultra Librarian. All rights reserved.; Manufacturer_Part_Number: SIR167DP-T1-GE3; RefDes: RefDes
R1 = RC0603JR-1347KL: 47kohm 0603 1/10w; Mfr_Name: Yageo; Copyright: Copyright (C) 2024 Ultra Librarian. All rights reserved.; Manufacturer_Part_Number: RC0603JR-1347KL; RefDes: RefDes; Type: DEV
R2 R6 = RESISTOR_100K_0.5%_0603: RES 100k OHM 0.5% 1/10W 0603; Tolerance: +/- 0.5%; Made By: John Ulm; ComponentLink1Description: Datasheet; ComponentLink1URL: https://www.bourns.com/docs/product-datasheets/CRxxxxx.pdf; Wattage: 1/10W; Supplier: Digikey; Digikey Part Numer: CR0603-JW-104ELFTR-ND; Supplier 1: Digi-Key; Supplier Part Number 1: 311-2395-1-ND
R3 = RESISTOR_10K_0603: as R10 on sheet Poactuator_Microcontroller; ComponentLink1Description: Datasheet; ComponentLink1URL: https://www.bourns.com/docs/product-datasheets/CRxxxxx.pdf; Supplier: Digikey; Digikey Part Numer: CR0603-JW-104ELFTR-ND; Supplier 1: Digi-Key; Supplier Part Number 1: 2019-RK73B1JTTD103JCT-ND
R5 = RESISTOR_1K_0402: RES 1k OHM 1% 1/16W 0402; Tolerance: +/- 1%; Made By: Robert Pafford; Wattage: 1/16W; Supplier: Digikey; Digikey Part Numer: CR0603-JW-104ELFTR-ND; Supplier 1: Digi-Key; Supplier Part Number 1: 13-AC0402FR-131KLCT-ND
R8 = RESISTOR_1K_0603: as R42 on sheet Poactuator_Connectors; ComponentLink1Description: Datasheet; ComponentLink1URL: https://www.bourns.com/docs/product-datasheets/CRxxxxx.pdf; Wattage: 1/8W; Supplier: Digikey; Digikey Part Numer: CR0603-JW-104ELFTR-ND; Supplier 1: Digi-Key; Supplier Part Number 1: 2019-RK73B1JTTD102JCT-ND
U10-U12 = TC4432EOA713: High-Side or Low-Side Gate Driver IC Non-Inverting 8-SOIC; Mfr_Name: Microchip; Copyright: Copyright (C) 2024 Ultra Librarian. All rights reserved.; Manufacturer_Part_Number: TC4432EOA713; RefDes: RefDes; Type: DEV
U13 = DG448DV-T1-E3: IC SWITCH SPST-NOX1 25OHM 6TSOP; Mfr_Name: Vishay; Copyright: Copyright (C) 2024 Ultra Librarian. All rights reserved.; Manufacturer_Part_Number: DG448DV-T1-E3; RefDes: RefDes; Type: DEV

## Nets that join several sheets
3V3: Poactuator_Connectors (R39.1), Poactuator_Power_Circuits (C4.1 U3.2 U3.4), Poactuator_Microcontroller (13 pins), Poactuator_KillSwitch (R2.1)
5V: Poactuator_Connectors (J5.5 J6.6 R42.1), Poactuator_Power_Circuits (6 pins), Poactuator_Microcontroller (5 pins)
12V: Poactuator_Connectors (LID_CONN1.2), Poactuator_Power_Circuits (C6.1 R11.1 U2.3)
15V: Poactuator_Connectors (J5.6 J6.7 J6.8 R41.1), Poactuator_Power_Circuits (6 pins), Poactuator_Microcontroller (R21.1)
GND: Poactuator_Connectors (27 pins), Poactuator_Power_Circuits (28 pins), Poactuator_Microcontroller (20 pins), Poactuator_KillSwitch (11 pins)
MOTOR_PWR: Poactuator_Connectors (J7.1 J8.1 R46.1), Poactuator_KillSwitch (Q2.D Q3.D Q4.D)
V+: Poactuator_Connectors (J5.3 R44.1), Poactuator_Power_Circuits (18 pins), Poactuator_KillSwitch (18 pins)
VPORT: Poactuator_Connectors (J3.1 J3.2 R45.1), Poactuator_Power_Circuits (Q7.D Q8.D U4.1)
Vreg: Poactuator_Connectors (R40.1), Poactuator_Power_Circuits (5 pins), Poactuator_Microcontroller (R20.1)
VSTBD: Poactuator_Connectors (J4.1 J4.2 R43.1), Poactuator_Power_Circuits (Q9.D Q10.D U6.1)
ACT_CHECK_5V: Poactuator_Connectors (LID_CONN1.4), Poactuator_Microcontroller (R47.1)
ACT_PWM_5V: Poactuator_Connectors (LID_CONN1.3), Poactuator_Microcontroller (R38.1)
AUX_SWITCH: Poactuator_Connectors (J1.4), Poactuator_Microcontroller (R34.2)
FAN_PWR: Poactuator_Connectors (J11.2), Poactuator_Microcontroller (Q5.3)
FAN_TACH: Poactuator_Connectors (J11.1), Poactuator_Microcontroller (R10.2)
KILL_SWITCH: Poactuator_Connectors (J1.3), Poactuator_KillSwitch (R8.2)
PORT_STAT: Poactuator_Power_Circuits (U4.4), Poactuator_Microcontroller (R31.2)
STBD_STAT: Poactuator_Power_Circuits (U6.4), Poactuator_Microcontroller (R30.2)